# EAGLE design rega (EAGLE 7.2.0)
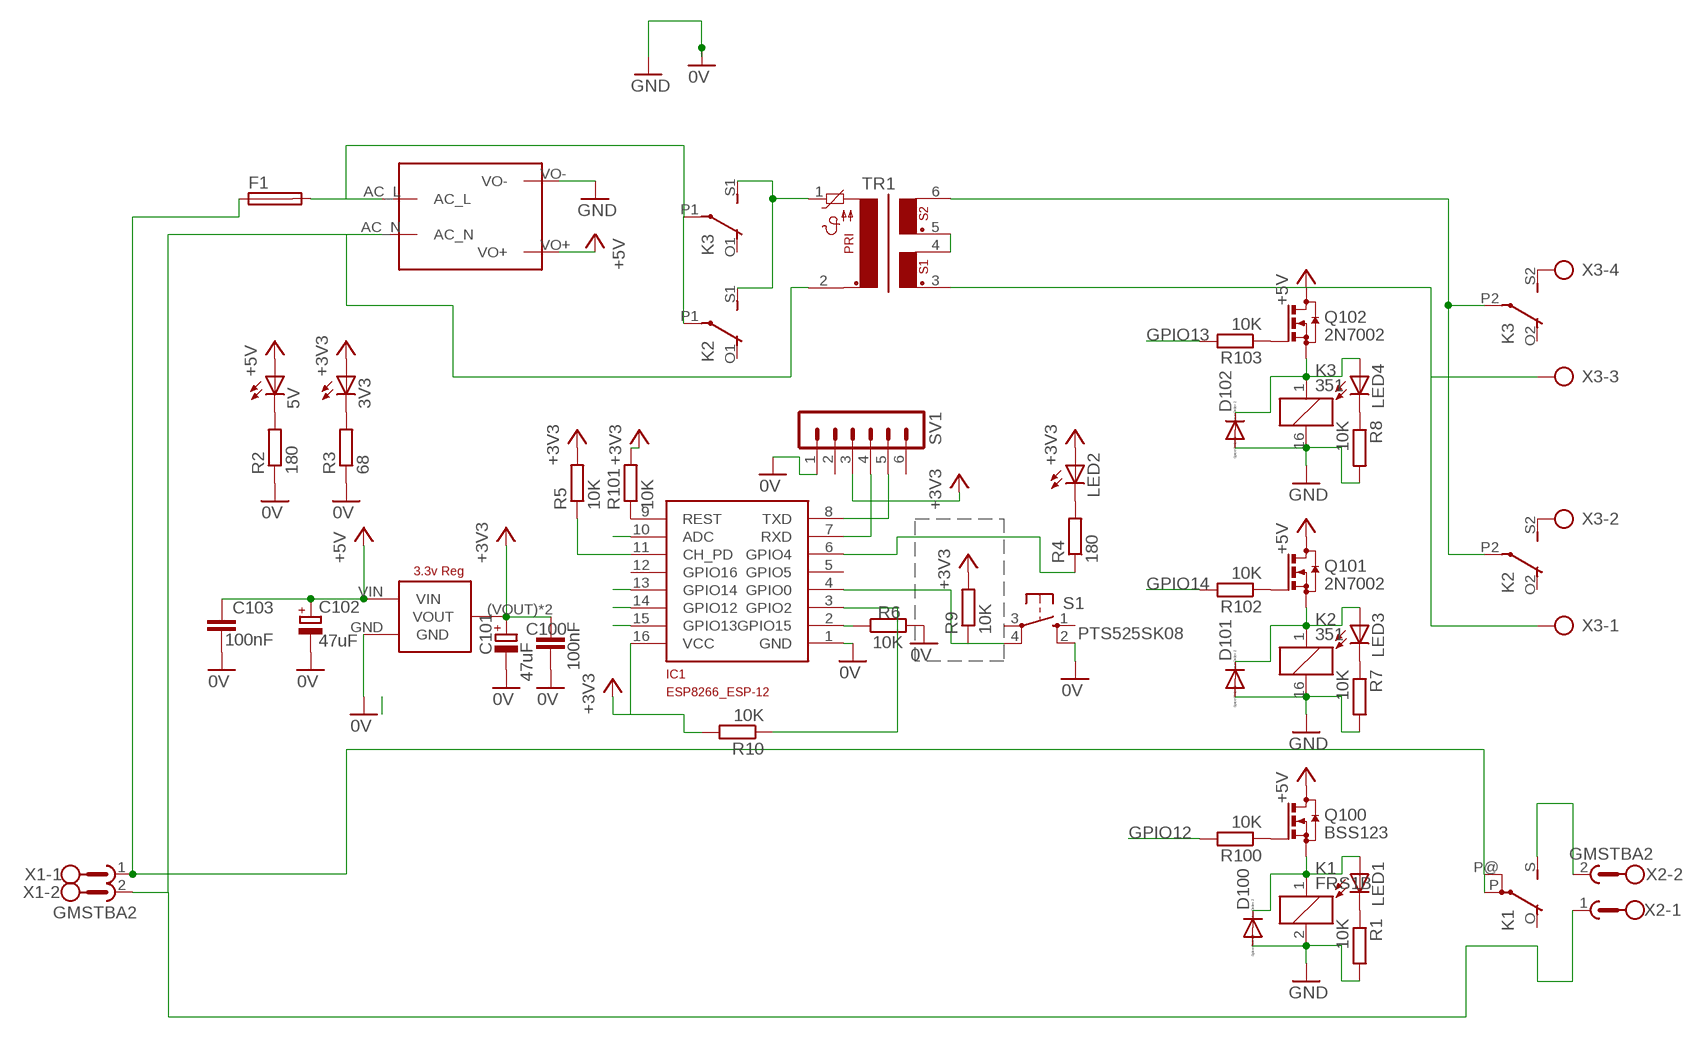
[diagram p0: schematic, sheet 1]

## Parts
3V3  LEDCHIPLED_0805  [CHIPLED_0805]
5V  LEDCHIPLED_0805  [CHIPLED_0805]
C100  100nF  C-EUC0805  [C0805]
C101  47uF  CPOL-EUCT3528  [CT3528]
C102  47uF  CPOL-EUCT3528  [CT3528]
C103  100nF  C-EUC0805  [C0805]
D100  DIODE-SOD80C  [SOD80C]
D101  DIODE-SOD80C  [SOD80C]
D102  DIODE-SOD80C  [SOD80C]
F1  LITTLEFUSESMD  [SMD]
IC1  ESP8266_ESP-12  [ESP8266-ESP12]
K1  FRS1B  [FRS1B]
K2  351  [351]
K3  351  [351]
LED1  LEDSML0805  [SML0805]
LED2  LEDCHIPLED_0805  [CHIPLED_0805]
LED3  LEDSML0805  [SML0805]
LED4  LEDSML0805  [SML0805]
Q100  BSS123  [SOT23]
Q101  2N7002  BSS123  [SOT23]
Q102  2N7002  BSS123  [SOT23]
R1  10K  R-EU_R0805  [R0805]
R2  180  R-EU_R0805  [R0805]
R3  68  R-EU_R0805  [R0805]
R4  180  R-EU_R0805  [R0805]
R5  10K  R-EU_R0805  [R0805]
R6  10K  R-EU_R0805  [R0805]
R7  10K  R-EU_R0805  [R0805]
R8  10K  R-EU_R0805  [R0805]
R9  10K  R-EU_R0805  [R0805]
R10  10K  R-EU_R0805  [R0805]
R100  10K  R-EU_R0805  [R0805]
R101  10K  R-EU_R0805  [R0805]
R102  10K  R-EU_R0805  [R0805]
R103  10K  R-EU_R0805  [R0805]
S1  PTS525SK08  [SM08]
SV1  MA06-1  [MA06-1]
TR1  PT13-2  [PT13-2]
U$1  MAINS_CONVERTERS  [HLK-PM01]
U$100  LD1117  [LD1117SOT-223]
X1  GMSTBA2  [GMSTBA2]
X2  GMSTBA2  [GMSTBA2]
X3  AK300/4  [AK300/4]

## Nets
+3V3: 3V3.A C100.1 C101.+ IC1.16(VCC) LED2.A R5.2 R9.2 R10.2 R101.2 SV1.3 U$100.(VOUT)(VOUT) U$100.VOUT
+5V: 5V.A C102.+ C103.1 Q100.3(D) Q101.3(D) Q102.3(D) U$1.VO+ U$100.VIN
ADC: IC1.10(ADC)
GND: C100.2 C101.- C102.- C103.2 D100.A D101.A D102.A IC1.1(GND) K1.2 K2.16 K3.16 R1.2 R2.1 R3.1 R6.2 R7.2 R8.2 S1.2(S) SV1.1 U$1.VO- U$100.GND ; supply symbol labelled 0V
GPIO2: IC1.3(GPIO2) R10.1
GPIO12: IC1.14(GPIO12) R100.2
GPIO13: IC1.15(GPIO13) R103.2
GPIO14: IC1.13(GPIO14) R102.2
N$2: F1.P$1 K1.P(2:P) K1.P@(2:P) X1.1
N$3: Q102.1(G) R103.1
N$4: IC1.2(GPIO15) R6.1
N$5: F1.P$2 K2.P1(2:P) K3.P1(2:P) U$1.AC_L
N$6: TR1.2 U$1.AC_N X1.2 X2.1
N$7: IC1.4(GPIO0) R9.1 S1.4(P)
N$8: IC1.11(CH_PD) R5.1
N$9: D101.C K2.1 LED3.A Q101.2(S)
N$11: 5V.C R2.2
N$12: TR1.3 X3.1 X3.3
N$13: LED4.C R8.1
N$14: 3V3.C R3.2
N$15: IC1.9(REST) R101.1
N$16: LED2.C R4.2
N$17: IC1.6(GPIO4) R4.1
N$18: D102.C K3.1 LED4.A Q102.2(S)
N$19: K2.P2(3:P) K3.P2(3:P) TR1.6
N$20: K3.S2(3:S) X3.4
N$21: K2.S1(2:S) K3.S1(2:S) TR1.1
N$22: K2.S2(3:S) X3.2
N$23: K1.S(2:S) X2.2
N$28: TR1.4 TR1.5
N$35: Q100.1(G) R100.1
N$36: Q101.1(G) R102.1
N$37: LED3.C R7.1
N$38: LED1.C R1.1
N$39: D100.C K1.1 LED1.A Q100.2(S)
RXD: IC1.7(RXD) SV1.4
TXD: IC1.8(TXD) SV1.5
Unconnected: IC1.5(GPIO5) IC1.12(GPIO16) K1.O(2:O) K2.O1(2:O) K2.O2(3:O) K3.O1(2:O) K3.O2(3:O) S1.1(S) S1.3(P) SV1.2 SV1.6

## Library data of the parts
3V3 5V LED1-LED4 = led:LED: LED OSRAM: - CHIPLED LG R971, LG N971, LY N971, LG Q971, LY Q971, LO R971, LY R971 LH N974, LH R974 LS Q976, LO Q976, LY Q976 LO Q996 - Hyper CHIPLED LW Q18S LB Q993, LB Q99A, LB R99A - SideLED LS A670, LO A670, LY A670, LG A670, LP A670 LB A673, LV A673, LT A673, LW A673 LH A674 LY A675 LS A676, LA A676, LO A676, LY A676, LW A676 LS A679, LY A679, LG A679 - Hyper Micro SIDELED® LS Y876, LA Y876, LO Y876, LY Y876 LT Y87S - SmartLED LW L88C, LW L88S LB L89C, LB L89S, LG L890 LS L89K, LO L89K, LY L89K LS L896, LA L896, LO L896, LY L896 - TOPLED LS T670, LO T670, LY T670, LG T670, LP T670 LSG T670, LSP T670, LSY T670, LOP T670, LYG T670 LG T671, LOG T671, LSG T671 LB T673, LV T673, LT T673, LW T673 LH T674 LS T676, LA T676, LO T676, LY T676, LB T676, LH T676, LSB T676, LW T676 LB T67C, LV T67C, LT T67C, LS T67K, LO T67K, LY T67K, LW E67C LS E67B, LA E67B, LO E67B, LY E67B, LB E67C, LV E67C, LT E67C LW T67C LS T679, LY T679, LG T679 LS T770, LO T770, LY T770, LG T770, LP T770 LB T773, LV T773, LT T773, LW T773 LH T774 LS E675, LA E675, LY E675, LS T675 LS T776, LA T776, LO T776, LY T776, LB T776 LHGB T686 LT T68C, LB T68C - Hyper Mini TOPLED® LB M676 - Mini TOPLED Santana® LG M470 LS M47K, LO M47K, LY M47K Source: http://www.osram.convergy.de LUXEON: - LUMILED® LXK2-PW12-R00, LXK2-PW12-S00, LXK2-PW14-U00, LXK2-PW14-V00 LXK2-PM12-R00, LXK2-PM12-S00, LXK2-PM14-U00 LXK2-PE12-Q00, LXK2-PE12-R00, LXK2-PE12-S00, LXK2-PE14-T00, LXK2-PE14-U00 LXK2-PB12-K00, LXK2-PB12-L00, LXK2-PB12-M00, LXK2-PB14-N00, LXK2-PB14-P00, LXK2-PB14-Q00 LXK2-PR12-L00, LXK2-PR12-M00, LXK2-PR14-Q00, LXK2-PR14-R00 LXK2-PD12-Q00, LXK2-PD12-R00, LXK2-PD12-S00 LXK2-PH12-R00, LXK2-PH12-S00 LXK2-PL12-P00, LXK2-PL12-Q00, LXK2-PL12-R00 Source: www.luxeon.com KINGBRIGHT: KA-3528ASYC Source: www.kingbright.com
C100 C103 = rcl:C-EU: CAPACITOR, European symbol
C101 C102 = rcl:CPOL-EU: POLARIZED CAPACITOR, European symbol
D100-D102 = diode:DIODE-: DIODE
F1 = fuse:LITTLEFUSE: LITTLEFUSE Picofuse/slow Littlefuse
IC1 = ESP8266-ESP12:ESP8266_ESP-12
K1 = relay:FRS1B: RELAY 1 x switch, same as V23101-D6-A201, Siemens
K2 K3 = relay:351: RELAY 2 x switch, Omron
Q100-Q102 = transistor-small-signal:BSS123: N-CHANNEL MOS FET
R1 R7 R8 R100 R102 R103 = resistor:R-EU_: RESISTOR, European symbol
R2-R6 R9 R10 R101 = rcl:R-EU_: RESISTOR, European symbol
S1 = pts525_20:PTS525*: PTS 525 Series Miniature Tact Switch for SMD Source: http://www.ck-components.com/14407/pts525_8sept14.pdf/; MF: C&K Components; MPN: PTS525SK08SMTR2LFS; OC_FARNELL: unknown; OC_NEWARK: unknown
SV1 = con-lstb:MA06-1: PIN HEADER; OC_FARNELL: unknown; OC_NEWARK: unknown
TR1 = trafo:PT13-2: TRANSFORMER 1 primary winding, temp. protection fuse, 2 secondary windings, mounting holes BLOCK
U$1 = captain-slow:MAINS_CONVERTERS
U$100 = LD1117:LD1117
X1 X2 = con-phoenix-762:GMSTBA2: PHOENIX; MF: FARNELL; MPN: 1757242; OC_FARNELL: 3705171; OC_NEWARK: 71C4161
X3 = con-ptr500:AK300/4: CONNECTOR; OC_FARNELL: unknown; OC_NEWARK: unknown

## Board
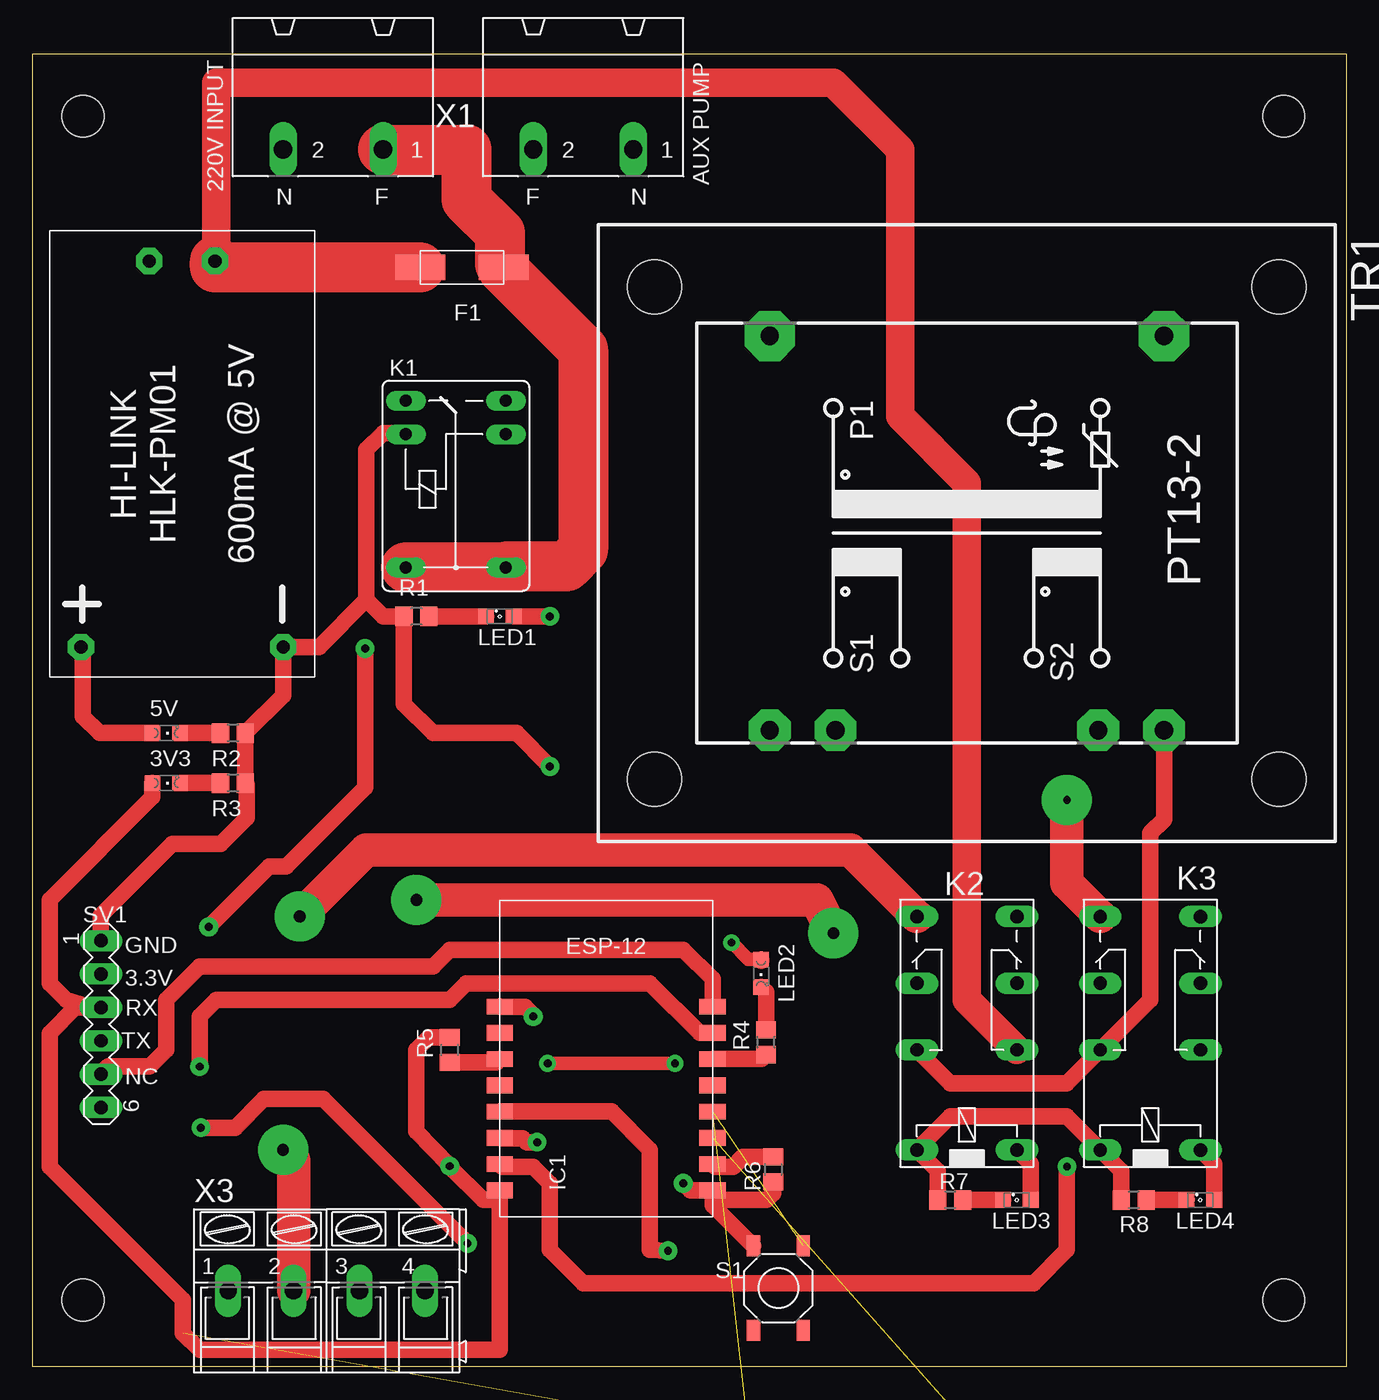
[diagram p1: board, top side]
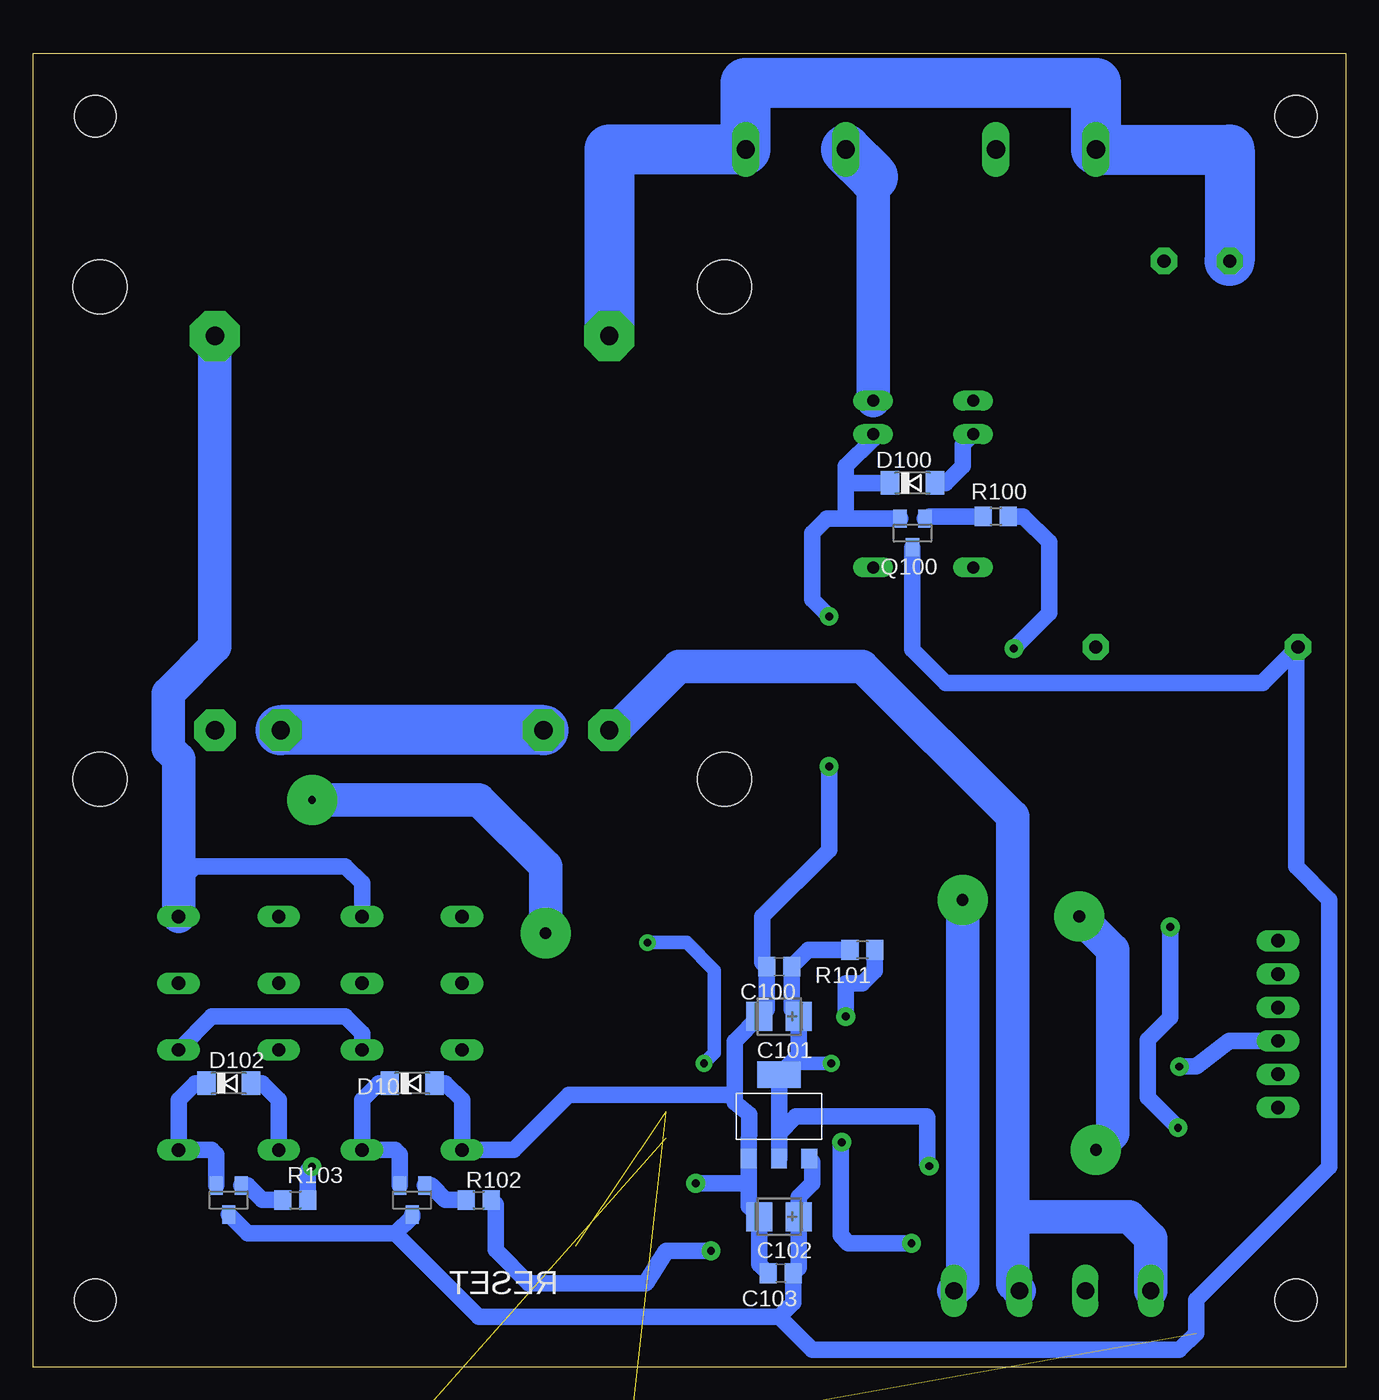
[diagram p2: board, bottom side, seen from below]

Size 100 x 100 mm. Coordinates in mm from the lower left corner, seen from the top.
Outline: 0,100 100,100 100,0 0,0 0,100
Copper layers (1*16): Top 0.035mm / dielectric 1.5mm / Bottom 0.035mm
Design rules "SparkFun": minimum track width 8mil, minimum drill 20mil, track to track 8mil, track to pad 8mil, pad to pad 8mil, via to via 8mil, smd to smd 8mil, copper to edge 10mil, drill to drill 8mil, minimum pad ring 12mil, minimum via ring 10mil, stop-mask expansion 4mil, vias tented up to drill 25mil, thermal gap 10mil
Holes 3.2 mm at 3.81,95.25 3.81,5.08 95.25,5.08 95.25,95.25

### Footprints (pad centres in the part's own frame; a part is rotated, then mirrored left to right if it is on the bottom)
CHIPLED_0805 = smd 1.2 x 1.2: A 0,-1.05; C 0,1.05
C0805 = smd 1.3 x 1.5: 1 -0.95,0; 2 0.95,0
CT3528 = smd 2 x 2.2: + -1.5,0; - 1.5,0
SOD80C = smd 1.4 x 1.8: A 1.7,0; C -1.7,0
SMD = smd 3.81 x 1.93: P$1 -3.175,0; P$2 3.175,0
ESP8266-ESP12 = smd 2 x 1.2: 1 16.2,2; 2 16.2,4; 3 16.2,6; 4 16.2,8; 5 16.2,10; 6 16.2,12; 7 16.2,14; 8 16.2,16; 9 0,16; 10 0,14; 11 0,12; 12 0,10; 13 0,8; 14 0,6; 15 0,4; 16 0,2
FRS1B = drill 0.914 long: 1 0,3.81; 2 0,-3.81; O -2.54,-3.81; P 10.16,3.81; P@ 10.16,-3.81; S -2.54,3.81
351 = drill 1.016 long: 1 -3.81,-3.81; 16 -3.81,3.81; O1 8.89,-3.81; O2 8.89,3.81; P1 3.81,-3.81; P2 3.81,3.81; S1 13.97,-3.81; S2 13.97,3.81
SML0805 = smd 1.2 x 1.2: A 1.05,0; C -1.05,0
SOT23 = smd 1 x 1.4: 1 -0.95,-1.1; 2 0.95,-1.1; 3 0,1.1
R0805 = smd 1.3 x 1.5: 1 -0.95,0; 2 0.95,0
SM08 = smd 1.6 x 1: 1 -3.2,1.9; 2 3.2,1.9; 3 -3.2,-1.9; 4 3.2,-1.9
MA06-1 = drill 1.016 long: 1 -6.35,0; 2 -3.81,0; 3 -1.27,0; 4 1.27,0; 5 3.81,0; 6 6.35,0
PT13-2 = drill 1.397 pad 3.81 octagon: 1 -15.011,15.011; 2 -15.011,-15.011 | drill 1.397 pad 3.175 octagon: 3 15.011,-15.011; 4 15.011,-10.008; 5 15.011,10.008; 6 15.011,15.011 | hole 4.115: 18.745,-23.774; -18.745,-23.774; 18.745,23.774; -18.745,23.774
HLK-PM01 = drill 1 pad 2 octagon: AC_L -14.7,2.5; AC_N -14.7,-2.5; VO+ 14.7,-7.7; VO- 14.7,7.7
LD1117SOT-223 = smd 3.3 x 2: (VOUT) 0,3.2 | smd 1.2 x 1.5: GND -2.3,-3.2; VIN 2.3,-3.2; VOUT 0,-3.2
GMSTBA2 = drill 1.397 long: 1 -3.81,5.08; 2 3.81,5.08
AK300/4 = drill 1.321 long: 1 -7.493,0; 2 -2.515,0; 3 2.515,0; 4 7.493,0

### Placement (x,y rotation side)
3V3  10.16,44.45 270 top
5V  10.16,48.26 270 top
C100  43.18,30.48 180 bottom
C101  43.18,26.67 180 bottom
C102  43.18,11.43 180 bottom
C103  43.06,7.12 180 bottom
D100  33.02,67.31 0 bottom
D101  71.12,21.59 0 bottom
D102  85.09,21.59 0 bottom
F1  32.67,83.72 180 top
IC1  35.56,11.43 0 top
K1  32.21,71.03 270 top
K2  71.12,20.32 90 top
K3  85.09,20.32 90 top
LED1  35.56,57.15 0 top
LED2  55.45,29.96 180 top
LED3  74.93,12.7 0 top
LED4  88.9,12.7 0 top
Q100  33.02,63.5 180 bottom
Q101  71.12,12.7 180 bottom
Q102  85.09,12.7 180 bottom
R1  29.21,57.15 180 top
R2  15.24,48.26 180 top
R3  15.24,44.45 180 top
R4  55.83,24.72 90 top
R5  31.75,24.13 90 top
R6  56.38,15.02 270 top
R7  69.85,12.7 180 top
R8  83.82,12.7 180 top
R9  55.5,-5.5 0 top  (outside the outline)
R10  73,-5.5 0 top  (outside the outline)
R100  26.67,64.77 0 bottom
R101  36.83,31.75 180 bottom
R102  66.04,12.7 0 bottom
R103  80.01,12.7 0 bottom
S1  56.77,5.99 90 top
SV1  5.18,26.09 270 top
TR1  71.12,63.5 270 top
U$1  11.37,69.52 270 top
U$100  43.18,19.05 0 bottom
X1  22.86,97.79 180 top
X2  41.91,97.79 180 top
X3  22.37,5.78 0 top

### Tracks (layer width: path | path; a pad name or v marks a point on that pad's centre or on a via)
+3V3  (via drill 0.6 pad 1.27, 0.6 pad 1.42)  (2 unrouted)
  Top 1.016: LED2.A 54.49,31.01 v53.2,32.3 | v48.9,23.1 v39.2,23.1
  Top 1.27: 3V3.A 9.11,43.4 1.27,35.56 1.27,29.21 2.54,27.94 4.6,27.34 SV1.3 3.23,27.36 1.27,25.4 1.27,15.24 11.43,5.08 11.43,2.54 12.7,1.27 35.56,1.27 35.56,12.7 35.2,13.06 | LED2.A 55.45,30.91 | 35.2,13.06 34.83,12.7 34.29,12.7 31.75,15.24 v31.75,15.28 29.21,17.92 29.21,24.13 30.16,25.08 R5.2 | 35.2,13.06 IC1.16
  Bottom 1.016: v53.2,32.3 50.2,32.3 48.1,30.2 48.1,23.9 v48.9,23.1 | v39.2,23.1 42.33,23.1 U$100.(VOUT)
  Bottom 1.27: R101.2 40.96,31.75 C100.1 42.23,27.22 C101.+ 41.68,23.75 U$100.(VOUT) U$100.VOUT 43.18,17.78 41.91,19.05 31.95,19.05 31.9,19 31.9,15.43 v31.75,15.28
+5V
  Top 1.27: 5V.A 5.08,48.26 3.81,49.53 3.81,54.68 U$1.VO+
  Bottom 1.27: Q100.3 33.02,54.61 30.48,52.07 6.42,52.07 | 6.42,52.07 U$1.VO+ | Q101.3 71.12,11.43 72.39,10.16 | 72.39,10.16 83.65,10.16 Q102.3 | U$100.VIN 40.64,15.61 40.64,13.97 41.68,12.93 C102.+ 41.68,7.55 C103.1 42.11,4.88 43.18,3.81 | 43.18,3.81 66.04,3.81 72.39,10.16 | 6.42,52.07 6.35,52.07 3.81,54.61 3.81,38.1 1.27,35.56 1.27,15.24 11.43,5.08 11.43,2.54 12.7,1.27 40.64,1.27 43.18,3.81
GND  (via drill 0.6 pad 1.42)
  Top 1.27: 25.4,58.42 26.67,57.15 R1.2 28.26,50.48 30.48,48.26 36.83,48.26 v39.37,45.72 | 25.4,58.42 25.4,69.85 26.67,71.12 28.31,71.12 K1.2 | 25.4,58.42 21.8,54.82 U$1.VO- 19.07,51.14 R2.1 R3.1 16.3,44.34 16.3,41.8 14.3,39.8 10.6,39.8 5.18,34.38 SV1.1 | R8.2 82.87,14.92 K3.16 78.74,19.05 69.85,19.05 K2.16 68.9,14.92 R7.2 | IC1.1 51.76,12.3 S1.2 | R6.2 56.38,13.2 55.88,12.7 52.49,12.7 IC1.1 | IC1.1 50.07,13.43 v49.53,13.97
  Bottom 1.27: D100.A 30.48,67.31 29.21,68.58 29.21,70.22 K1.2 | D102.A 82.55,21.59 81.28,20.32 K3.16 | D101.A 68.58,21.59 67.31,20.32 K2.16 63.39,16.51 59.2,20.7 46.66,20.7 46.56,20.8 | 45.48,13.97 U$100.GND 45.46,19.23 46.56,20.12 46.56,20.8 | 45.48,13.97 45.48,12.23 C102.- 44.68,7.79 C103.2 | v39.37,45.72 39.37,39.37 44.45,34.29 44.45,30.8 C100.2 44.13,27.22 C101.- 46.56,24.79 46.56,20.8 | v49.53,13.97 45.48,13.97
GPIO2  (1 unrouted)
GPIO12  (via drill 0.6 pad 1.42)
  Top 1.27: v25.3,54.7 25.3,44.1 19.3,38.1 18,38.1 v13.4,33.5 | v12.8,18.2 15.4,18.2 17.6,20.4 22.1,20.4 v33.1,9.4 | v38.4,17.1 37.6,17.1 37.3,17.4 35.59,17.4 IC1.14
  Bottom 1.27: R100.2 24.57,64.77 22.6,62.8 22.6,57.4 v25.3,54.7 | v13.4,33.5 13.4,26.6 15.1,24.9 15.1,20.5 v12.8,18.2 | v33.1,9.4 37.9,9.4 38.5,10 38.5,17 v38.4,17.1
GPIO13  (via drill 0.6 pad 1.42)
  Top 1.27: v78.74,15.24 78.74,8.89 76.2,6.35 41.91,6.35 39.37,8.89 39.37,13.97 38.1,15.24 35.75,15.24 IC1.15
  Bottom 1.27: R103.2 79.06,14.92 v78.74,15.24
GPIO14  (via drill 0.6 pad 1.42)
  Top 1.27: IC1.13 44.07,19.43 46.99,16.51 46.99,8.89 v48.36,8.82
  Bottom 1.27: v48.36,8.82 51.77,8.82 53.34,6.35 62.23,6.35 64.77,8.89 64.77,12.38 R102.2
N$2
  Top 3.81: X1.1 33.02,92.71 33.02,88.9 35.56,86.36 35.56,84 F1.P$1 35.84,83.53 41.91,77.47 41.91,62.23 40.64,60.96 36.11,60.96 K1.P K1.P@
N$3
  Bottom 1.27: Q102.1 83.65,13.8 82.55,12.7 R103.1
N$4
  Top 1.27: R6.1 54.07,15.97 53.34,15.24 51.95,15.24 IC1.2
N$5
  Top 2.184: F1.P$2 14.07,83.72 13.97,83.82 13.97,97.79 60.96,97.79 66.04,92.71 66.04,72.39 71.12,67.31 71.12,27.94 K2.P1
  Top 3.81: F1.P$2 13.87,83.72 U$1.AC_L
  Bottom 1.27: K2.P1 74.93,25.4 76.2,26.67 86.36,26.67 K3.P1
N$6
  Bottom 3.81: TR1.2 56.11,92.71 X2.1 45.72,97.79 19.05,97.79 X1.2 8.87,92.71 U$1.AC_N
N$7  (2 unrouted)
N$8
  Top 1.27: R5.1 35.31,23.18 IC1.11
N$9
  Top 1.27: LED3.A 75.98,15.46 K2.1
  Bottom 1.27: D101.C 73.66,21.59 74.93,20.32 K2.1 72.39,16.51 72.07,16.19 Q101.2
N$11
  Top 1.27: 5V.C R2.2
N$12
  Bottom 2.54: TR1.3 55.65,48.49 50.8,53.34 36.83,53.34 25.4,41.91 25.4,11.43 | 25.4,11.43 25.4,6.29 X3.3 | X3.1 14.88,9.8 16.51,11.43 25.4,11.43
N$13
  Top 1.27: LED4.C R8.1
N$14
  Top 1.27: R3.2 3V3.C
N$15  (via drill 0.6 pad 1.42)
  Top 1.27: v38.1,26.67 38.1,26.8 37.5,27.4 35.59,27.4 IC1.9
  Bottom 1.27: R101.1 35.88,30.16 36.83,29.21 38.1,29.21 v38.1,26.67
N$16
  Top 1.27: R4.2 55.83,28.53 LED2.C
N$17
  Top 1.27: IC1.6 55.49,23.43 R4.1
N$18
  Top 1.27: LED4.A 89.95,15.46 K3.1
  Bottom 1.27: D102.C 87.63,21.59 88.9,20.32 K3.1 86.36,16.51 86.04,16.19 Q102.2
N$19
  Top 1.27: TR1.6 86.13,41.68 85.09,40.64 85.09,27.94 K3.P2 78.74,21.59 69.85,21.59 K2.P2
N$20  (via drill 0.6 pad 3.81, 0.9 pad 3.81)
  Top 2.54: K3.S2 78.74,36.83 v78.74,43.18 | v60.96,33.02 59.69,35.56 v29.21,35.56
  Bottom 2.54: v78.74,43.18 66.04,43.18 60.96,38.1 v60.96,33.02 | v29.21,35.56 29.21,6.43 X3.4
N$21
  Bottom 1.27: K2.S1 74.93,36.83 76.2,38.1 87.63,38.1 88.9,36.83 K3.S1
  Bottom 2.54: TR1.1 86.13,54.84 89.7,51.27 89.7,47.1 88.9,46.3 K3.S1
N$22  (via drill 0.9 pad 3.81)
  Top 2.54: K2.S2 62.23,39.37 25.4,39.37 v20.32,34.29 | X3.2 19.86,15.71 v19.05,16.51
  Bottom 2.54: v19.05,16.51 17.78,17.78 17.78,31.75 v20.32,34.29
N$23
  Bottom 2.54: K1.S 36.02,90.63
  Bottom 3.81: 36.02,90.63 X2.2
N$28
  Bottom 3.81: TR1.4 TR1.5
N$35
  Bottom 1.27: Q100.1 31.92,64.6 31.75,64.77 R100.1
N$36
  Bottom 1.27: Q101.1 69.68,13.8 68.58,12.7 R102.1
N$37
  Top 1.27: LED3.C R7.1
N$38
  Top 1.27: LED1.C R1.1
N$39  (via drill 0.6 pad 1.42)
  Top 1.27: v39.37,57.15 LED1.A
  Bottom 1.27: Q100.2 38.1,64.6 | 38.1,64.6 39.54,64.6 40.64,63.5 40.64,58.42 v39.37,57.15 | K1.1 36.02,70.66 38.1,68.58 38.1,67.31 | 38.1,67.31 38.1,64.6 | D100.C 38.1,67.31
RXD  (via drill 0.6 pad 1.42)
  Top 1.27: IC1.7 50.77,25.43 46.99,29.21 33.02,29.21 31.75,27.94 13.97,27.94 12.7,26.67 v12.7,22.86
  Bottom 1.27: v12.7,22.86 11.43,22.86 8.89,24.8 5.76,24.8 SV1.4
TXD
  Top 1.27: IC1.8 51.76,29.52 49.53,31.75 31.75,31.75 30.48,30.48 12.7,30.48 10.16,27.94 10.16,24.13 8.89,22.86 5.76,22.86 SV1.5

### Text on the board
tNames: 220V INPUT | AUX PUMP | N | F | F | N | GND | 3.3V | RX | TX | NC
bNames: RESET